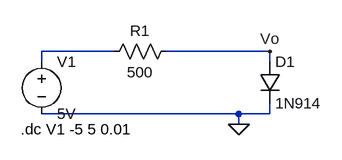
[diagram p0: schematic lab01.asc]
lab01.asc, the LTspice schematic file:
Version 4.1
SHEET 1 880 680
WIRE -112 112 -224 112
WIRE 128 112 -32 112
WIRE -224 128 -224 112
WIRE 128 128 128 112
WIRE 80 208 -224 208
WIRE 128 208 128 192
WIRE 128 208 80 208
WIRE 80 224 80 208
FLAG 128 112 Vo
FLAG 80 224 0
SYMBOL diode 112 128 R0
SYMATTR InstName D1
SYMATTR Value 1N914
SYMBOL res -16 96 R90
WINDOW 0 0 56 VBottom 2
WINDOW 3 32 56 VTop 2
SYMATTR InstName R1
SYMATTR Value 500
SYMBOL voltage -224 112 R0
WINDOW 123 0 0 Left 0
WINDOW 39 0 0 Left 0
SYMATTR InstName V1
SYMATTR Value 5V
TEXT -256 232 Left 2 !.dc V1 -5 5 0.01

The netlist it stands for:
* lab01.asc
D1 Vo 0 1N914
R1 Vo N001 500
V1 N001 0 5V
.model D D
.lib standard.dio
.dc V1 -5 5 0.01
.backanno
.end